# Altium schematic sheet Main_Board.SchDoc
size A4; SheetNumber: 1; SheetTotal: 3
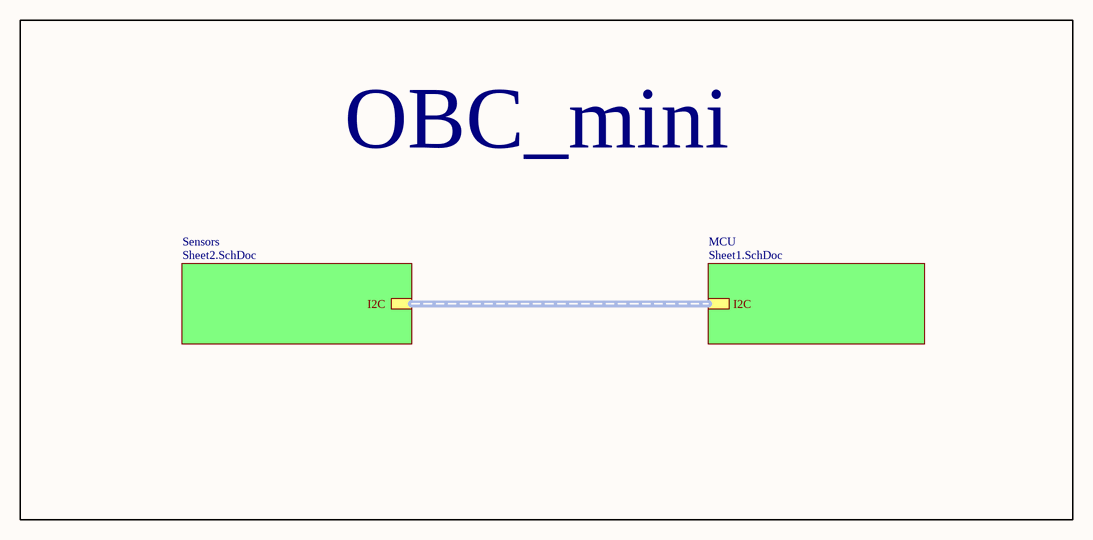
[diagram p0: Main_Board.SchDoc]

## Sub-sheets
MCU = Sheet1.SchDoc: I2C
Sensors = Sheet2.SchDoc: I2C

## Buses and harness runs
harness sheet MCU/I2C = sheet Sensors/I2C

## Notes on the sheet
- OBC_mini